# EAGLE design FINAL_1_withhbridge (EAGLE 6.5.0)
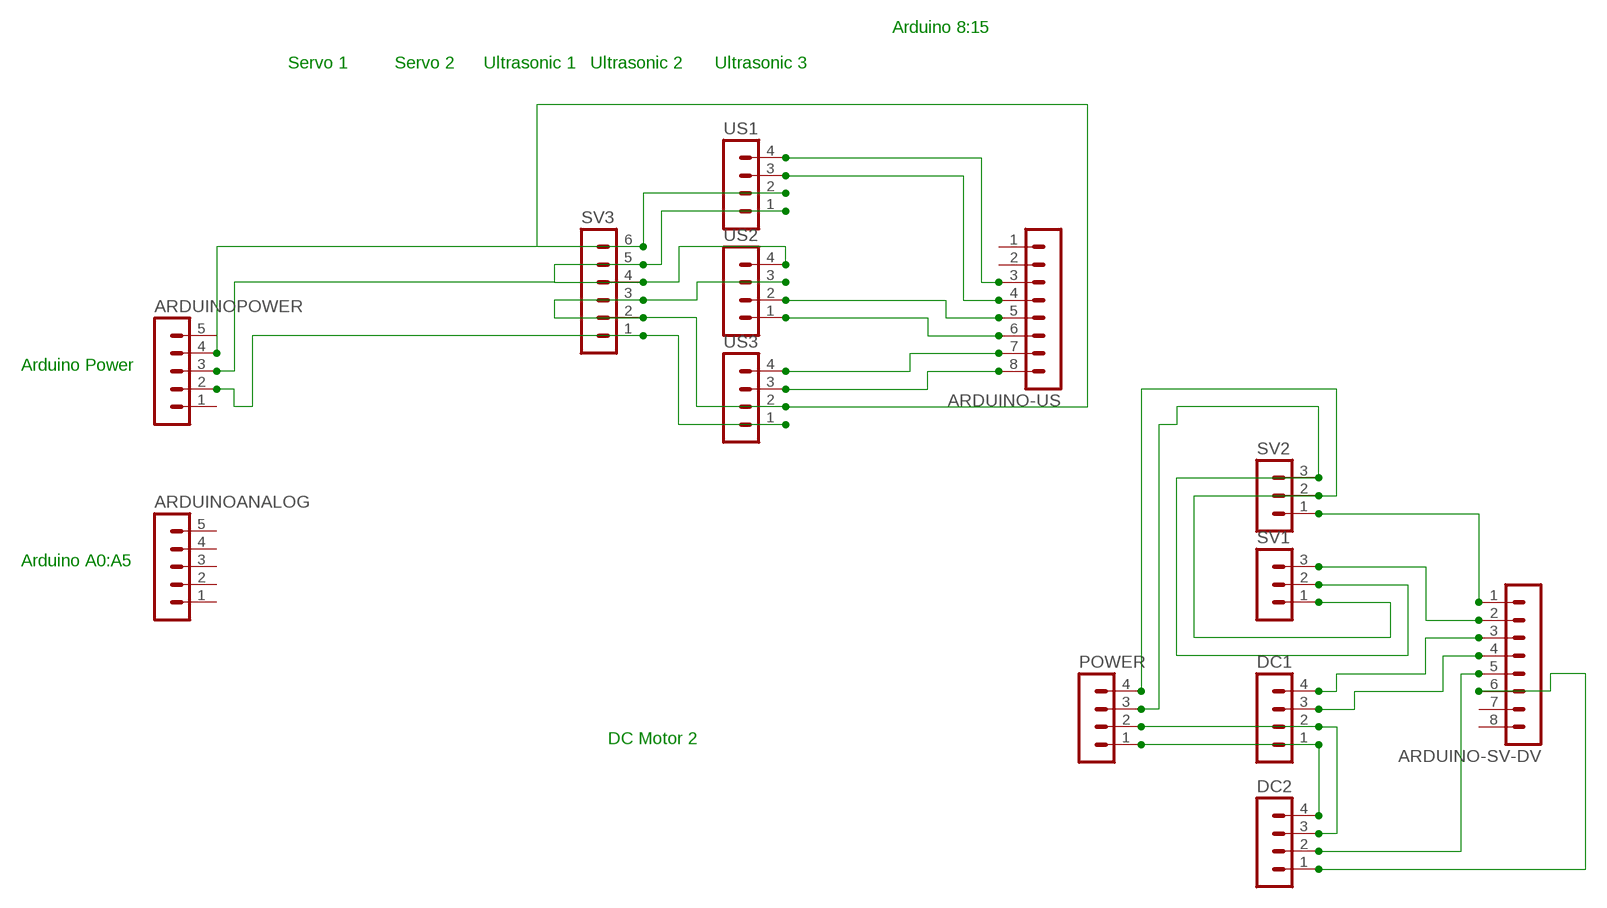
[diagram p0: schematic, sheet 1]

## Parts
ARDUINO-SV-DV  MA08-1W  [MA08-1W]
ARDUINO-US  MA08-1W  [MA08-1W]
ARDUINOANALOG  MA05-1  [MA05-1]
ARDUINOPOWER  MA05-1  [MA05-1]
DC1  MA04-1  [MA04-1]
DC2  MA04-1  [MA04-1]
POWER  MA04-1  [MA04-1]
SV1  MA03-1  [MA03-1]
SV2  MA03-1  [MA03-1]
SV3  MA06-1  [MA06-1]
US1  MA04-1  [MA04-1]
US2  MA04-1  [MA04-1]
US3  MA04-1  [MA04-1]

## Nets
5V2: POWER.3 SV1.2 SV2.3
5V3: DC1.1 DC2.4 POWER.1
5VSS: ARDUINOPOWER.4 SV3.2 SV3.3 SV3.6 US1.2 US2.3 US3.2
GND2: POWER.4 SV1.1 SV2.2
GND3: DC1.2 DC2.3 POWER.2
GNDSS: ARDUINOPOWER.2 SV3.1 US3.1
SGN3: ARDUINO-SV-DV.3 DC1.4
SGN4: ARDUINO-SV-DV.4 DC1.3
SGN5: ARDUINO-SV-DV.5 DC2.2
SGN6: ARDUINO-SV-DV.6 DC2.1
SGNN2: ARDUINO-SV-DV.2 SV1.3
SIG1: ARDUINO-SV-DV.1 SV2.1
US1: ARDUINO-US.3 US1.4
US2: ARDUINO-US.4 US1.3
US3: ARDUINO-US.5 US2.2
US4: ARDUINO-US.6 US2.1
US5: ARDUINO-US.7 US3.4
US6: ARDUINO-US.8 US3.3
USGND: ARDUINOPOWER.3 SV3.4 SV3.5 US1.1 US2.4
Unconnected: ARDUINO-SV-DV.7 ARDUINO-SV-DV.8 ARDUINO-US.1 ARDUINO-US.2 ARDUINOANALOG.1 ARDUINOANALOG.2 ARDUINOANALOG.3 ARDUINOANALOG.4 ARDUINOANALOG.5 ARDUINOPOWER.1 ARDUINOPOWER.5

## Notes on the sheet
- Arduino 8:15
- Servo 1 | Servo 2 | Ultrasonic 1 | Ultrasonic 2 | Ultrasonic 3
- Arduino Power
- Arduino A0:A5
- DC Motor 2

## Library data of the parts
ARDUINO-SV-DV ARDUINO-US = con-lstb:MA08-1W: PIN HEADER; OC_FARNELL: unknown; OC_NEWARK: unknown
ARDUINOANALOG ARDUINOPOWER = con-lstb:MA05-1: PIN HEADER; OC_FARNELL: unknown; OC_NEWARK: unknown
DC1 DC2 POWER US1-US3 = con-lstb:MA04-1: PIN HEADER; OC_FARNELL: unknown; OC_NEWARK: unknown
SV1 SV2 = con-lstb:MA03-1: PIN HEADER; OC_FARNELL: unknown; OC_NEWARK: unknown
SV3 = con-lstb:MA06-1: PIN HEADER; OC_FARNELL: unknown; OC_NEWARK: unknown

## Board
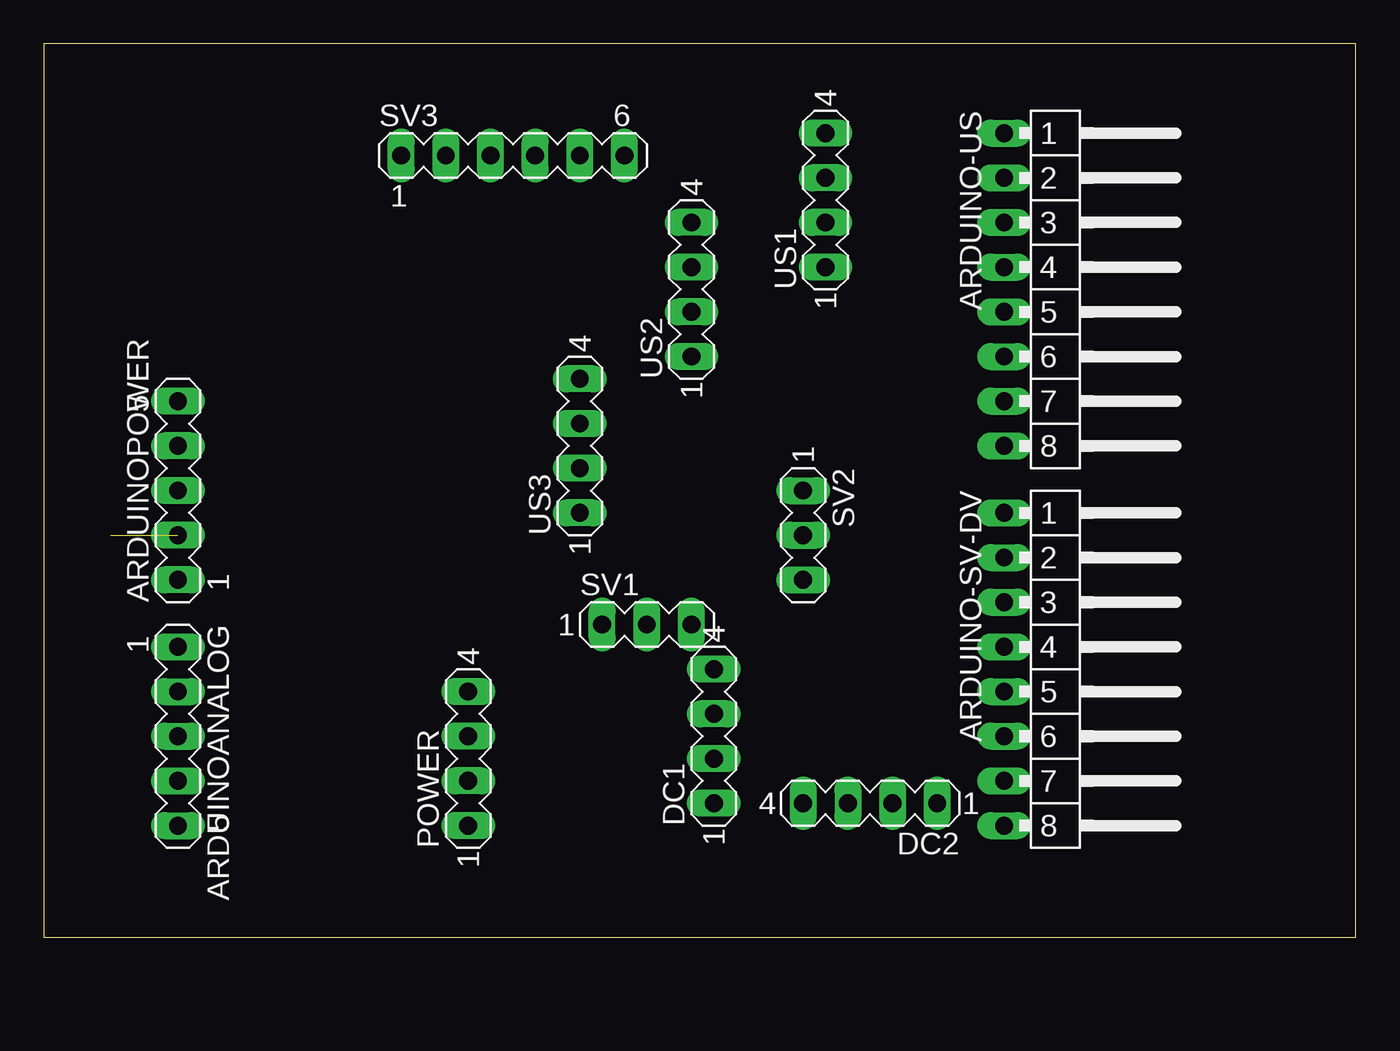
[diagram p1: board, top side]
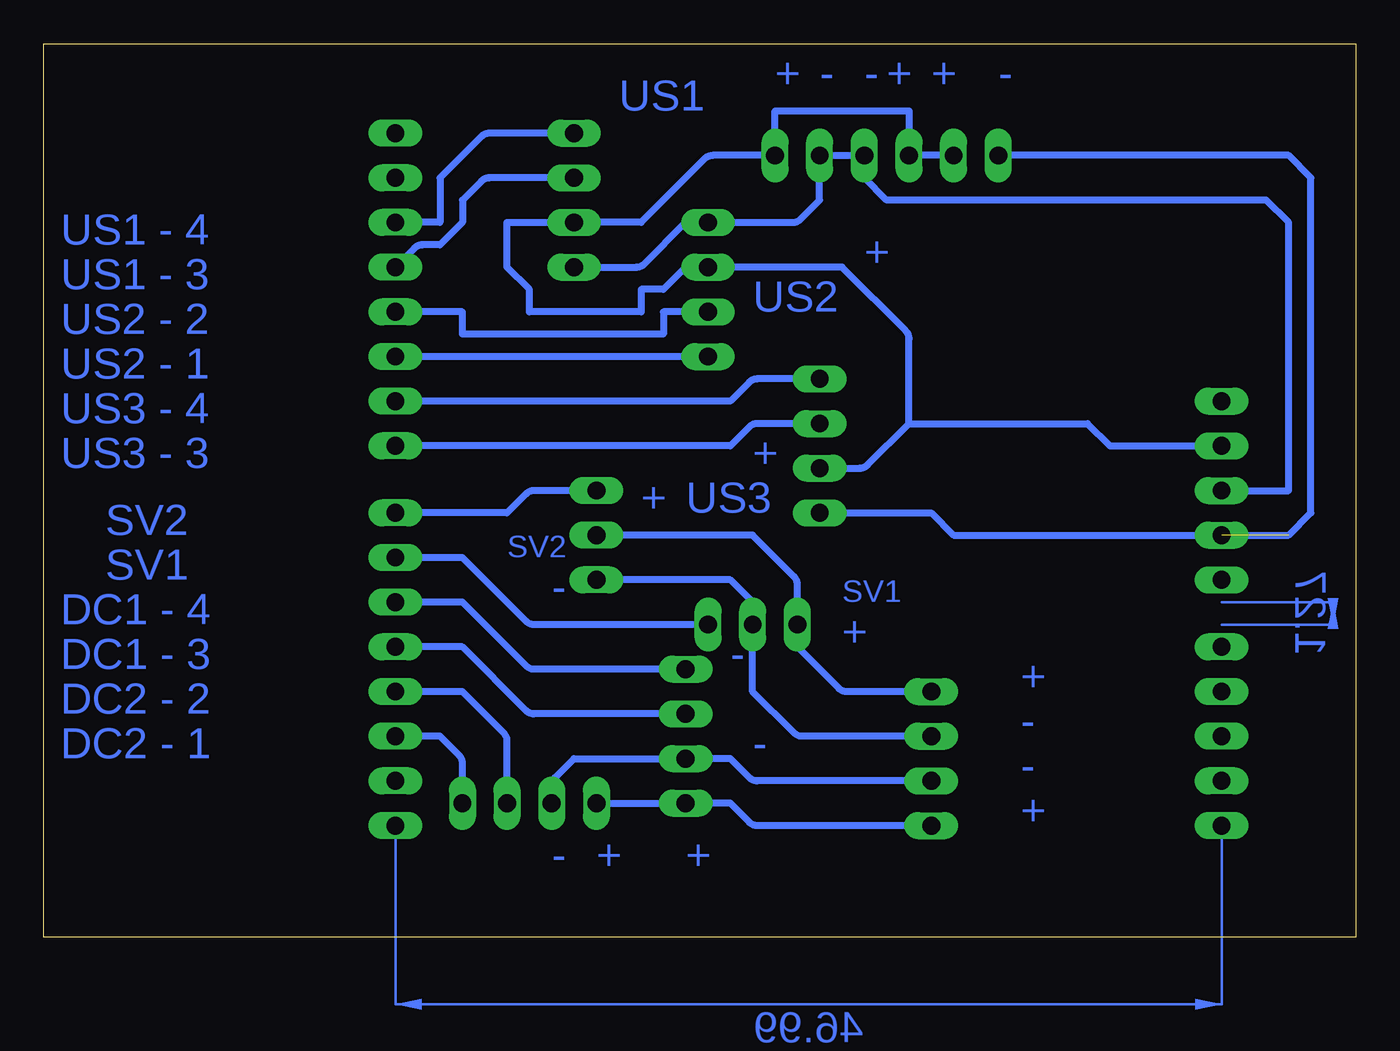
[diagram p2: board, bottom side, seen from below]

Size 74.6 x 50.79 mm. Coordinates in mm from the lower left corner, seen from the top.
Outline: 0,0 74.6,0 74.6,50.79 0,50.79 0,0
Copper layers (1*16): Top 0.035mm / dielectric 1.5mm / Bottom 0.035mm
Design rules "default": minimum track width 10mil, minimum drill 24mil, track to track 8mil, track to pad 8mil, pad to pad 8mil, via to via 8mil, smd to smd 8mil, copper to edge 40mil, drill to drill 8mil, minimum pad ring 10mil, minimum via ring 8mil, stop-mask expansion 4mil, vias tented up to drill 0mil, thermal gap 10mil

### Footprints (pad centres in the part's own frame; a part is rotated, then mirrored left to right if it is on the bottom)
MA08-1W = drill 1.016 long: 1 -8.89,0; 2 -6.35,0; 3 -3.81,0; 4 -1.27,0; 5 1.27,0; 6 3.81,0; 7 6.35,0; 8 8.89,0
MA05-1 = drill 1.016 long: 1 -5.08,0; 2 -2.54,0; 3 0,0; 4 2.54,0; 5 5.08,0
MA04-1 = drill 1.016 long: 1 -3.81,0; 2 -1.27,0; 3 1.27,0; 4 3.81,0
MA03-1 = drill 1.016 long: 1 -2.54,0; 2 0,0; 3 2.54,0
MA06-1 = drill 1.016 long: 1 -6.35,0; 2 -3.81,0; 3 -1.27,0; 4 1.27,0; 5 3.81,0; 6 6.35,0

### Placement (x,y rotation side)
ARDUINO-SV-DV  54.61,15.24 270 top
ARDUINO-US  54.61,36.83 270 top
ARDUINOANALOG  7.62,11.43 270 top
ARDUINOPOWER  7.62,25.4 90 top
DC1  38.1,11.43 90 top
DC2  46.99,7.62 180 top
POWER  24.13,10.16 90 top
SV1  34.29,17.78 0 top
SV2  43.18,22.86 270 top
SV3  26.67,44.45 0 top
US1  44.45,41.91 90 top
US2  36.83,36.83 90 top
US3  30.48,27.94 90 top

### Tracks (layer width: path | path; a pad name or v marks a point on that pad's centre or on a via)
5V2
  Bottom 0.406: POWER.3 31.49,11.43 arc45 31.94,11.62 34.29,13.97 SV1.2 34.29,18.79 arc-45 34.48,19.24 35.56,20.32 SV2.3
5V3
  Bottom 0.406: POWER.1 34.03,6.35 arc45 34.48,6.54 35.56,7.62 DC1.1 DC2.4
5VSS
  Bottom 0.406: SV3.2 SV3.3 25.4,46.99 33.02,46.99 SV3.6 36.57,44.45 arc-45 37.02,44.26 40.64,40.64 US1.2 48.26,40.64 48.26,38.1 46.99,36.83 46.99,35.56 40.64,35.56 40.64,36.83 39.37,36.83 38.29,37.91 arc45 37.84,38.1 US2.3 29.21,38.1 25.59,34.48 arc45 25.4,34.03 25.4,29.21 | US3.2 28.2,26.67 arc-45 27.75,26.86 25.4,29.21 | 25.4,29.21 15.24,29.21 13.97,27.94 ARDUINOPOWER.4
GND2
  Bottom 0.406: POWER.4 28.95,13.97 arc45 29.4,14.16 31.75,16.51 SV1.1 31.75,20.06 arc-45 31.94,20.51 34.29,22.86 SV2.2
GND3
  Bottom 0.406: POWER.2 34.03,8.89 arc45 34.48,9.08 35.56,10.16 DC1.2 44.45,10.16 45.53,9.08 arc-45 45.72,8.63 DC2.3
GNDSS  (1 unrouted)
  Bottom 0.406: US3.1 24.13,24.13 22.86,22.86 3.81,22.86 2.54,24.13 2.54,43.18 3.81,44.45 SV3.1
SGN3
  Bottom 0.406: DC1.4 46.73,15.24 arc45 47.18,15.43 50.8,19.05 ARDUINO-SV-DV.3
SGN4
  Bottom 0.406: DC1.3 46.73,12.7 arc45 47.18,12.89 50.8,16.51 ARDUINO-SV-DV.4
SGN5
  Bottom 0.406: DC2.2 48.26,11.17 arc-45 48.45,11.62 50.8,13.97 ARDUINO-SV-DV.5
SGN6
  Bottom 0.406: DC2.1 50.8,9.9 arc-45 50.99,10.35 52.07,11.43 ARDUINO-SV-DV.6
SGNN2
  Bottom 0.406: SV1.3 46.73,17.78 arc45 47.18,17.97 50.8,21.59 ARDUINO-SV-DV.2
SIG1
  Bottom 0.406: SV2.1 46.73,25.4 arc-45 47.18,25.21 48.26,24.13 ARDUINO-SV-DV.1
US1
  Bottom 0.406: US1.4 49.27,45.72 arc-45 49.72,45.53 52.07,43.18 52.07,40.64 ARDUINO-US.3
US2
  Bottom 0.406: US1.3 49.27,43.18 arc-45 49.72,42.99 50.8,41.91 50.8,40.64 52.07,39.37 53.08,39.37 arc-45 53.53,39.18 ARDUINO-US.4
US3
  Bottom 0.406: US2.2 39.37,35.56 39.37,34.29 50.8,34.29 50.8,35.56 ARDUINO-US.5
US4
  Bottom 0.406: US2.1 ARDUINO-US.6
US5
  Bottom 0.406: US3.4 34.03,31.75 arc-45 34.48,31.56 35.56,30.48 ARDUINO-US.7
US6
  Bottom 0.406: US3.3 34.03,29.21 arc-45 34.48,29.02 35.56,27.94 ARDUINO-US.8
USGND
  Bottom 0.406: US1.1 40.9,38.1 arc-45 40.45,38.29 38.1,40.64 US2.4 32.01,40.64 arc-45 31.56,40.83 30.48,41.91 SV3.5 SV3.4 27.94,43.18 26.67,41.91 5.08,41.91 3.81,40.64 3.81,25.4 ARDUINOPOWER.3
(copper drawn outside any net)
  shapes: Bottom area x2

### Text on the board
Bottom: - | + | + | - | - | + | US1 | US1 - 4 | + | US1 - 3 | US2 | US2 - 2 | US2 - 1 | US3 - 4 | + | US3 - 3 | US3 | + | SV2 | SV2 | SV1 | SV1 | - | DC1 - 4 | + | - | DC1 - 3 | + | DC2 - 2 | - | - | DC2 - 1 | - | + | + | + | -